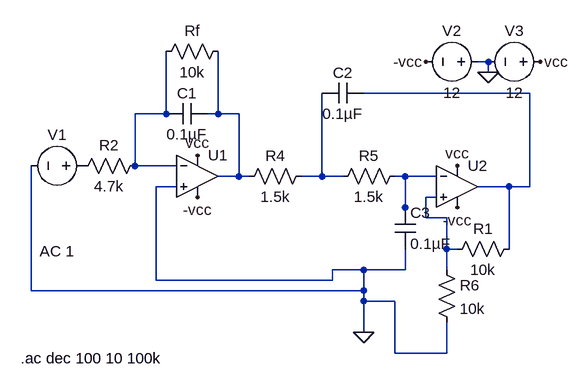
[diagram p0: schematic Draft1.asc]
Draft1.asc, the LTspice schematic file:
Version 4.1
SHEET 1 880 680
WIRE 560 32 544 32
WIRE 560 48 560 32
WIRE 624 80 368 80
WIRE 64 112 64 16
WIRE 64 112 16 112
WIRE 144 112 144 16
WIRE 144 112 128 112
WIRE 176 112 144 112
WIRE 16 192 16 112
WIRE 80 192 16 192
WIRE 176 208 176 112
WIRE 176 208 144 208
WIRE 192 208 176 208
WIRE 304 208 304 80
WIRE 304 208 272 208
WIRE 336 208 304 208
WIRE 432 208 416 208
WIRE 480 208 432 208
WIRE 80 224 48 224
WIRE 592 224 544 224
WIRE 624 224 624 80
WIRE 624 224 592 224
WIRE 480 240 464 240
WIRE 432 256 432 208
WIRE 432 272 432 256
WIRE 464 272 464 240
WIRE 496 272 464 272
WIRE 496 320 496 272
WIRE 512 320 496 320
WIRE 592 320 592 224
WIRE 368 352 320 352
WIRE 432 352 432 320
WIRE 432 352 368 352
WIRE 496 352 496 320
WIRE 48 368 48 224
WIRE 320 368 320 352
WIRE 320 368 48 368
WIRE -144 384 -144 192
WIRE 368 384 368 352
WIRE 368 384 -144 384
WIRE 368 400 368 384
WIRE 416 400 368 400
WIRE 368 448 368 400
WIRE 416 480 416 400
WIRE 496 480 496 432
WIRE 496 480 416 480
FLAG 368 448 0
FLAG 560 48 0
FLAG 640 32 vcc
FLAG 464 32 -vcc
FLAG 112 176 vcc
FLAG 112 240 -vcc
FLAG 512 256 -vcc
FLAG 512 192 vcc
SYMBOL OpAmps\\UniversalOpAmp2 112 208 R0
SYMATTR InstName U1
SYMBOL OpAmps\\UniversalOpAmp2 512 224 R0
SYMATTR InstName U2
SYMBOL res 608 304 R90
WINDOW 0 0 56 VBottom 2
WINDOW 3 32 56 VTop 2
SYMATTR InstName R1
SYMATTR Value 10k
SYMBOL res 32 176 R90
WINDOW 0 0 56 VBottom 2
WINDOW 3 32 56 VTop 2
SYMATTR InstName R2
SYMATTR Value 4.7k
SYMBOL cap 128 96 R90
WINDOW 0 0 32 VBottom 2
WINDOW 3 32 32 VTop 2
SYMATTR InstName C1
SYMATTR Value 0.1µF
SYMBOL res 160 0 R90
WINDOW 0 0 56 VBottom 2
WINDOW 3 32 56 VTop 2
SYMATTR InstName Rf
SYMATTR Value 10k
SYMBOL res 288 192 R90
WINDOW 0 0 56 VBottom 2
WINDOW 3 32 56 VTop 2
SYMATTR InstName R4
SYMATTR Value 1.5k
SYMBOL res 432 192 R90
WINDOW 0 0 56 VBottom 2
WINDOW 3 32 56 VTop 2
SYMATTR InstName R5
SYMATTR Value 1.5k
SYMBOL cap 368 64 R90
WINDOW 0 0 32 VBottom 2
WINDOW 3 32 32 VTop 2
SYMATTR InstName C2
SYMATTR Value 0.1µF
SYMBOL cap 416 256 R0
SYMATTR InstName C3
SYMATTR Value 0.1µF
SYMBOL res 480 336 R0
SYMATTR InstName R6
SYMATTR Value 10k
SYMBOL voltage -48 192 R90
WINDOW 0 -32 56 VBottom 2
WINDOW 3 88 56 VTop 2
WINDOW 123 116 56 VTop 2
WINDOW 39 0 0 Left 0
SYMATTR InstName V1
SYMATTR Value ""
SYMATTR Value2 AC 1
SYMBOL voltage 560 32 R90
WINDOW 0 -32 56 VBottom 2
WINDOW 3 32 56 VTop 2
WINDOW 123 0 0 Left 0
WINDOW 39 0 0 Left 0
SYMATTR InstName V2
SYMATTR Value 12
SYMBOL voltage 656 32 R90
WINDOW 0 -32 56 VBottom 2
WINDOW 3 32 56 VTop 2
WINDOW 123 0 0 Left 0
WINDOW 39 0 0 Left 0
SYMATTR InstName V3
SYMATTR Value 12
TEXT -160 488 Left 2 !.ac dec 100 10 100k

The netlist it stands for:
* Draft1.asc
X§U1 0 N002 vcc -vcc N003 level2 Avol=1Meg GBW=10Meg Slew=10Meg Ilimit=25m Rail=0 Vos=0 En=0 Enk=0 In=0 Ink=0 Rin=500Meg  ; pins In+ In- V+ V- OUT
X§U2 N006 N005 vcc -vcc N001 level2 Avol=1Meg GBW=10Meg Slew=10Meg Ilimit=25m Rail=0 Vos=0 En=0 Enk=0 In=0 Ink=0 Rin=500Meg  ; pins In+ In- V+ V- OUT
R1 N001 N006 10k
R2 N002 P001 4.7k
C1 N003 N002 0.1µF
Rf N003 N002 10k
R4 N004 N003 1.5k
R5 N005 N004 1.5k
C2 N001 N004 0.1µF
C3 N005 0 0.1µF
R6 N006 0 10k
V1 P001 0 AC 1
V2 0 -vcc 12
V3 vcc 0 12
.ac dec 100 10 100k
.lib UniversalOpAmp2.lib
.backanno
.end